# Altium project PCB_Project.PrjPcb (part 1 of 2)
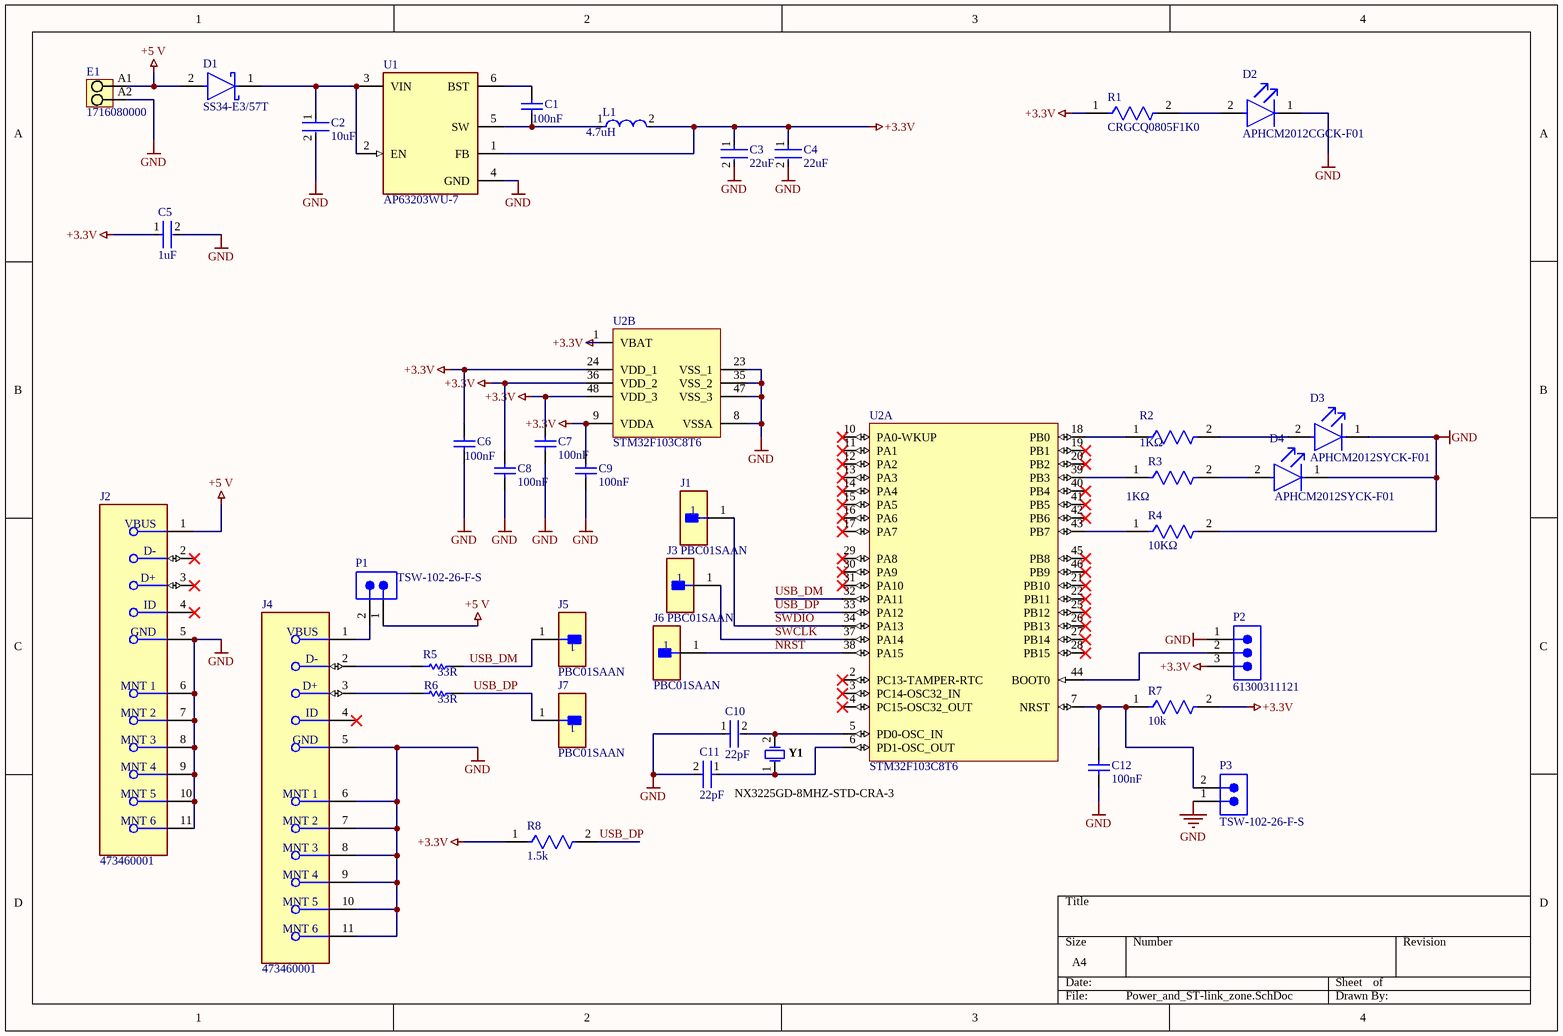
[diagram p0: Power_and_ST-link_zone.SchDoc]
6 sheets, 119 parts. Net scope: global (net labels, ports and power ports of the same name join across sheets).
Board file: PCB1.PcbDoc
Sheets:
  Power_and_ST-link_zone.SchDoc
  Signal_Switching.SchDoc
  Peripherals.SchDoc
  MCU_H7.SchDoc
  MCU_L4.SchDoc
  MCU_WL.SchDoc

## Sheet Power_and_ST-link_zone.SchDoc
size A4; SheetNumber: 1; SheetTotal: 5

### Parts
(Parts that share a designator on the sheet are numbered #1, #2 ... from top to bottom, then left to right.)
C1  100nF  [CAPC2013X145X50NL20T25]
C2  10uF  [FP-C1206C-EH-MFG]
C3  22uF  [FP-GRM21B-0_2-e0_2_0_7-MFG]
C4  22uF  [FP-GRM21B-0_2-e0_2_0_7-MFG]
C5  1uF  [FP-CC0805-0_85-MFG]
C6  100nF  [CAPC2013X145X50NL20T25]
C7  100nF  [CAPC2013X145X50NL20T25]
C8  100nF  [CAPC2013X145X50NL20T25]
C9  100nF  [CAPC2013X145X50NL20T25]
C10  22pF  [FP-C0805C-DN-MFG]
C11  22pF  [FP-C0805C-DN-MFG]
C12  100nF  [CAPC2013X145X50NL20T25]
D1  SS34-E3/57T  [FP-95402-MFG]
D2  APHCM2012CGCK-F01  [FP-APHCM2012CGCK-F01-MFG]
D3  APHCM2012SYCK-F01  [FP-APHCM2012SYCK-F01-MFG]
D4  APHCM2012SYCK-F01  [FP-APHCM2012SYCK-F01-MFG]
E1  1716080000  [LM_5_08_90_02]
J1  PBC01SAAN  [FP-PBC01SAAN-MFG]
J2  473460001  [FP-473460001-MFG]
J3#1  PBC01SAAN  [FP-PBC01SAAN-MFG]
J4  473460001  [FP-473460001-MFG]
J5  PBC01SAAN  [FP-PBC01SAAN-MFG]
J6  PBC01SAAN  [FP-PBC01SAAN-MFG]
J7  PBC01SAAN  [FP-PBC01SAAN-MFG]
L1  4.7uH  [FP-DEM3518C-MFG]
P1  TSW-102-26-F-S  [SMTC-TSW-102-26-XX-S]
P2  61300311121  [61300311121]
P3  TSW-102-26-F-S  [SMTC-TSW-102-26-XX-S]
R1  CRGCQ0805F1K0  [FP-CRGCQ0805-IPC_C]
R2  1KΩ  [FP-CRGCQ0805-IPC_C]
R3  1KΩ  [FP-CRGCQ0805-IPC_C]
R4  10KΩ  [FP-CRGP0805-IPC_C]
R5  33R  [RESC2013X50X30ML20T20]
R6  33R  [RESC2013X50X30ML20T20]
R7  10k  [FP-CRGP0805-IPC_C]
R8#1  1.5k  [FP-CRGCQ0805-IPC_C]
U1  AP63203WU-7  [FP-TSOT26-MFG]
U2  STM32F103C8T6  [STM-LQFP48_L]  (parts A,B of 2)
Y1  NX3225GD-8MHZ-STD-CRA-3  [NDK-NX3225GD-8MHZ-STD-CRA-3_V]

### Nets
+3.3V: C3.1 C4.1 C5.1 C6.2 C7.2 C8.2 C9.2 L1.2 P2.3 R1.1 R7.2 R8#1.1 U1.1(FB) U2.1(VBAT) U2.9(VDDA) U2.24(VDD_1) U2.36(VDD_2) U2.48(VDD_3)
+5 V: D1.2(A) E1.A1 J2.1(VBUS) P1.1
GND: C2.2 C3.2 C4.2 C5.2 C6.1 C7.1 C8.1 C9.1 C10.1 C11.2 C12.1 D2.1(C) D3.1(C) D4.1(C) E1.A2 J2.5(GND) J2.6(MNT_1) J2.7(MNT_2) J2.8(MNT_3) J2.9(MNT_4) J2.10(MNT_5) J2.11(MNT_6) J4.5(GND) J4.6(MNT_1) J4.7(MNT_2) J4.8(MNT_3) J4.9(MNT_4) J4.10(MNT_5) J4.11(MNT_6) P2.1 P3.1 R4.2 U1.4(GND) U2.8(VSSA) U2.23(VSS_1) U2.35(VSS_2) U2.47(VSS_3)
NRST: J6.1 U2.38(PA15)
SWCLK: J3#1.1 U2.37(PA14)
SWDIO: J1.1 U2.34(PA13)
USB_DM: J5.1 R5.2 U2.32(PA11)
USB_DP: J7.1 R6.2 R8#1.2 U2.33(PA12)
NetC1_1: C1.1 L1.1 U1.5(SW)
NetC1_2: C1.2 U1.6(BST)
NetC2_1: C2.1 D1.1(C) U1.2(EN) U1.3(VIN)
NetC10_2: C10.2 U2.5(PD0-OSC_IN) Y1.2
NetC11_1: C11.1 U2.6(PD1-OSC_OUT) Y1.1
NetC12_2: C12.2 P3.2 R7.1 U2.7(NRST)
NetD2_2: D2.2(A) R1.2
NetD3_2: D3.2(A) R2.2
NetD4_2: D4.2(A) R3.2
NetJ4_1: J4.1(VBUS) P1.2
NetJ4_2: J4.2(D-) R5.1
NetJ4_3: J4.3(D+) R6.1
NetP2_2: P2.2 U2.44(BOOT0)
NetR2_1: R2.1 U2.18(PB0)
NetR3_1: R3.1 U2.39(PB3)
NetR4_1: R4.1 U2.43(PB7)

Not connected (* = marked no-connect by the designer): J2 2(D-)* 3(D+)* 4(ID)*; J4 4(ID)*; U2 2(PC13-TAMPER-RTC)* 3(PC14-OSC32_IN)* 4(PC15-OSC32_OUT)* 10(PA0-WKUP)* 11(PA1)* 12(PA2)* 13(PA3)* 14(PA4)* 15(PA5)* 16(PA6)* 17(PA7)* 19(PB1)* 20(PB2)* 21(PB10)* 22(PB11)* 25(PB12)* 26(PB13)* 27(PB14)* 28(PB15)* 29(PA8)* 30(PA9)* 31(PA10)* 40(PB4)* 41(PB5)* 42(PB6)* 45(PB8)* 46(PB9)*

### Library data of the parts
C1 C6-C9 C12 = CMP-2007-01227-1: Manufacturer: Kemet; Part Number: C0805S104K5RACTU
C2 = CMP-03020-004605-1: CAP CER 10UF 25V X7R 1206; Manufacturer Part Number: C1206C106K3RACAUTO; Manufacturer: KEMET; Material: Ceramic; Automotive Grade: Grade 1; Temperature Coefficient: 15%; Tolerance: 10%; Digikey Description: CAP CER 10UF 25V X7R 1206; Lead Free: Yes; Temperature Characteristic: X7R; Temperature: -55°C to +125°C; Temperature Range Low: -55°C; Octopart: https://octopart.com/c1206c106k3racauto-kemet-65707106; Temperature Range High: +125°C; RoHS: TRUE; Package: C1206C-EH; Device Class L1: Passive Components; Device Class L3: Ceramic Capacitors; Automotive: Yes; Value: 10uF; Category: Cap; ComponentLink2Description: Datasheet; Capacitance: 10uF; Height: 1.8mm; ComponentLink2URL: https://content.kemet.com/datasheets/KEM_C1023_X7R_AUTO_SMD.pdf; Voltage Rating: 25V; Device Class L2: Capacitors; Ipc Land Pattern Name: CAPC320160X160
C3 C4 = CMP-06035-051066-1: Chip Multilayer Ceramic Capacitors for General Purpose, 0805, 22uF, X7R, 15%, 20%, 10V
C5 = CMP-03422-000058-1: CC0805 1 uF X7R 10.00% 16 V; Manufacturer: Yageo; Manufacturer Part Number: CC0805KFX7R7BB105; Material: Ceramic; Tolerance: 0.1; Voltage Rating: 16 V; ComponentLink2URL: http://www.yageo.com/documents/recent/UPY-GPHC_Y5V_6.3V-to-50V_8.pdf; Capacitance: 1 uF; Octopart: https://octopart.com/cc0805kfx7r7bb105-yageo-30261725; Footprint Url: http://www.yageo.com/exep/pages/download/literatures/UPY-C_GEN_24.pdf; ComponentLink2Description: Datasheet; Ipc Land Pattern Name: CAPC200125X85; Category: Cap; Device Class L1: Passive Components; Temperature Range High: +85°C; Mouser Description: Multilayer Ceramic Capacitors MLCC - SMD/SMT 1.0uF 16V X7R 10%; Height: 0.95mm; Automotive: No; Device Class L3: Ceramic Capacitors; Temperature: -30°C to +85°C; Temperature Range Low: -30°C; Temperature Characteristic: X7R; Device Class L2: Capacitors; Lead Free: Yes; Value: 1 uF; RoHS: TRUE; Package: CC0805-0.85
C10 C11 = CMP-03020-031064-1: C0805 22 pF C0G 30ppm/°C 10.00% 50 V; Manufacturer Part Number: C0805C220K5GACAUTO; Manufacturer: KEMET; Tolerance: 0.1; Voltage Rating: 50 V; Material: Ceramic; Temperature Range High: +125°C; Package: C0805C-DN; Device Class L1: Passive Components; ComponentLink2URL: https://content.kemet.com/datasheets/KEM_C1003_C0G_SMD.pdf; Lead Free: Yes; Value: 22 pF; Height: 0.88mm; Temperature: -55°C to +125°C; RoHS: TRUE; Device Class L2: Capacitors; Category: Cap; ComponentLink2Description: Datasheet; Device Class L3: Ceramic Capacitors; Automotive: No; Capacitance: 22 pF; Octopart: https://octopart.com/c0805c220k5gacauto-kemet-56246248; Temperature Coefficient: 30ppm/°C; Ipc Land Pattern Name: CAPC200125X78; Temperature Characteristic: C0G; Temperature Range Low: -55°C
D1 = CMP-02539-000012-1: DIODE SCHOTTKY 40V 3A DO214AB; Manufacturer: Vishay; Max Junction Temp: +150°C; Peak Reverse Current: 0.5mA; Max Surge Forward Current: 100A; Standoff Height: 0mm; ComponentLink2Description: Datasheet; Device Class L3: Schottky Diodes; Height: 2.62mm; Max Repetitive Reverse Voltage: 40V; Lead Free: Yes; Package: 95402; Temperature Range High: +150°C; ComponentLink2URL: http://www.vishay.com/docs/88751/ss32.pdf; Temperature: -55°C to +150°C; Footprint Url: http://www.vishay.com/docs/95402/smc.pdf; Automotive: No; Forward Current: 3A; Category: Diode; Manufacturer Part Number: SS34-E3/57T; RoHS: TRUE; Device Class L2: Diodes; Mouser Description: Schottky Diodes & Rectifiers 3.0 Amp 40 Volt; Octopart: https://octopart.com/ss34-e3%2F57t-vishay-39552907; Temperature Range Low: -55°C; Device Class L1: Discrete Semiconductors; Digikey Description: DIODE SCHOTTKY 40V 3A DO214AB
D2 = CMP-44529-000062-1: LED GREEN CLEAR CHIP SMD; Dominant Wavelength: 570nm; Forward Current: 20mA; Number of LEDs: 1; Luminous Intensity: 40mcd; Forward Voltage: 2.1V; Viewing Angle: 110°; Illumination Color: Green; Lens Style: Clear; Mount: Surface Mount; Length: 2mm; Max Operating Temperature: 85°C; Series: APHCM; Width: 1.25mm; Lead Free: Lead Free; Wavelength: 570nm; Package Quantity: 1; Number of Pins: 2; Case Code (Metric): 2012; RoHS Compliant: Yes; Packaging: Tape and Reel; Lens Color: Clear; Case/Package: 0805; Case Code (Imperial): 0805; Test Current: 20mA; Color: Green; Min Operating Temperature: -40°C; Height: 0.4mm
D3 D4 = CMP-44529-000064-1: LED YELLOW CLEAR CHIP SMD; Number of LEDs: 1; Luminous Intensity: 150mcd; Dominant Wavelength: 590nm; Test Current: 20mA; Illumination Color: Green; Forward Voltage: 2V; Viewing Angle: 110°; Number of Pins: 2; Packaging: Tape and Reel; Width: 1.25mm; Height: 0.4mm; Lens Color: Clear; RoHS Compliant: Yes; Lead Free: Lead Free; Min Operating Temperature: -40°C; Case Code (Imperial): 0805; Case/Package: 0805; Series: APHCM; Wavelength: 590nm; Max Operating Temperature: 85°C; Length: 2mm; Color: Yellow; Package Quantity: 2000; Mount: Surface Mount; Lens Style: Clear; Forward Current: 20mA; Case Code (Metric): 2012
E1 = CMP-1559-01766-1: OMNIMATE Signal - series LM; Manufacturer: Weidmueller; Solder_pin_length_mm: 3,5 mm; Solid_max_H05_07_V_U: 2,5 mm²; Contact_material: Cu-Leg; No_of_poles: 2; Mounting_onto_the_PCB: Solder connection; Contact_surface: tinned; Wire_cross_section_AWG_max_UL_1059: AWG 14; Rated_voltage_for_surge_voltage_class_pollution_degree_II_2: 630 V; Side_termination_characteristic: closed side; UL_94_flammability_rating: V-0; Wire_cross_section_AWG_min_UL_1059: AWG 24; Pitch_mm: 5,08 mm; Pitch_inch: 0,2 inch; Rated_voltage_use_group_B_UL_1059: 300 V; Solid_min_H05_07_V_U: 0,2 mm²; Short_text_for_material: LM 5.08/02/90 3.5SN OR BX; Insulating_material: Wemid (PA); Rated_current_use_group_B_UL_1059: 15 A; PartNumber: 1716080000; Colour: Orange; ComponentLink1URL: http://www.weidmueller.com/; ComponentLink1Description: Manufacturer URL; Revision: V1; Qty: 500 PCS; ComponentLink2Description: URL Link1; ComponentLink2URL: http://catalog.weidmueller.com/catalog/Start.do?localeId=en&ObjectID=1716080000; Packaging: Box; PackageReference: LM_5_08_90_02
J1 J3#1 J5-J7 = CMP-25680-000032-1: CONN HEADER VERT 1POS; Number of Positions: 1; Connector Type: Male Pin; Gender: Male; Pitch: 2.54mm; Contact Material: Bronze; Mount: Through Hole; Length: 2.54mm; Height: 2.54mm; Lead Free: Lead Free; Number of Rows: 1; Contact Plating: Gold; Number of Contacts: 1; Housing Material: Plastic; Termination: Solder; Package Quantity: 1; Packaging: Bulk; Color: Black; Contact Mating Length: 0.23inch; Housing Color: Black; Width: 2.54mm
J2 J4 = CMP-2000-05246-2: CONN RCPT USB2.0 MICRO B SMD R/A; Manufacturer: Molex; Conn Orientation: Right Angle; Is Female: yes; Shielding: true; Pitch: 0.65mm; Number Of Contacts: 5; Voltage Rating: 30V; Current Rating: 1.8A; Device Class L2: USB Connectors; Digikey Description: CONN RCPT USB2.0 MICRO B SMD R/A; Height: 2.945mm; RoHS: TRUE; ComponentLink2Description: Datasheet; Octopart: https://octopart.com/47346-0001-molex-7164928; Automotive: No; Package: 0; Category: Conn; Device Class L1: Connectors; Usb Standard: USB 2.0; Temperature: -30°C to +85°C; Temperature Range Low: -30°C; Footprint Url: https://www.molex.com/pdm_docs/sd/473460001_sd.pdf; ComponentLink2URL: https://www.molex.com/webdocs/datasheets/pdf/en-us/0473460001_IO_CONNECTORS.pdf; Lead Free: Yes; Manufacturer Part Number: 473460001; Contact Material: Gold,Nickel; Temperature Range High: +85°C; Device Class L3: unset
L1 = CMP-06042-016301-1: FIXED IND; Shielding: Shielded; Saturation Current: 1.35A; Test Frequency: 100kHz; DC Resistance (DCR): 72mR; Core Material: Ferrite; Current Rating: 2A; Tolerance: 20%; Height - Seated (Max): 0.071inch; RoHS Compliant: Yes; Length: 0.146inch; Min Operating Temperature: -40°C; Max Operating Temperature: 85°C; Mount: Surface Mount; Case/Package: Nonstandard; Width: 0.154inch; Packaging: Tape and Reel; Resistor Type: Wirewound; Inductance: 4.7uH
P1 P3 = CMP-1024-00329-1: 0.025" SQ Post Header, Through-hole, Vertical, -55 to 125 degC, 2.54 mm Pitch, 2-Pin, Male, RoHS; Manufacturer: Samtec; Pitch: 2.54 mm; PackageVersion: DM, 8/1988; ComponentLink2Description: Datasheet; PackageReference: TSW-102-26-XX-S; ComponentLink3URL: http://www.samtec.com/documents/webfiles/cpdf/TSW-XXX-XX-XXX-X-XX-XXX-MKT.pdf; ComponentLink2URL: http://www.samtec.com/documents/webfiles/pdf/TSW_TH.PDF; ComponentLink1Description: Manufacturer URL; DatasheetVersion: F-214; RoHS: True; ComponentLink3Description: Package Specification; PartNumber: TSW-102-26-F-S; Temperature Range: -55 to 125 degC; Orientation: Vertical; ComponentLink1URL: http://www.samtec.com; PackageDescription: .025[0.64] SQ. Post Terminal Strip Assembly; Mounting Technology: Through-hole
P2 = CMP-1502-01062-3: NexarPartId: 32855521; Current Rating: 3A; Voltage Rating: 250V; Number of Positions: 3; Pitch: 2.54mm; Contact Resistance: 20mΩ; Connector Type: Male Pin; Gender: Male; REACH SVHC: Unknown; Packaging: Bulk; Contact Material: Copper; Min Operating Temperature: -40°C; Number of Rows: 1; Orientation: Vertical; RoHS: Compliant; Contact Plating: Gold; Max Operating Temperature: 105°C; Mount: Through Hole; Height: 8.94mm; Operating Supply Voltage: 250V; Number of Pins: 3; Contact Mating Length: 5.9944mm; Number of Contacts: 3; Color: Black; Lead Free: Lead Free; Lead Pitch: 2.54mm; Termination: Solder
R1 = CMP-03211-004613-1: CRGCQ 0805 1K0 1%; Manufacturer: TE Connectivity; Value: 1KΩ; Power Rating: 0.125W; Temperature Coefficient: ±100ppm/°C; Tolerance: 0.01; Automotive Grade: Grade 685; Voltage Rating: 150V; Digikey Description: CRGCQ 0805 1K0 1%; Octopart: https://octopart.com/crgcq0805f1k0-te+connectivity-91018154; ComponentLink2Description: Datasheet; Ipc Land Pattern Name: RESC200125X55; Device Class L2: Resistors; Device Class L1: Passive Components; Category: Res; Device Class L3: Chip SMD Resistors; Temperature Range Low: -55°C; Temperature Range High: +155°C; Automotive: Yes; Height: 0.65mm; Resistance: 1KΩ; ComponentLink2URL: https://www.te.com/commerce/DocumentDelivery/DDEController?Action=showdoc&DocId=Data+Sheet%7F1773204-3%7F1%7Fpdf%7FEnglish%7FENG_DS_1773204-3_1.pdf%7F4-2176341-694; Manufacturer Part Number: CRGCQ0805F1K0; Series: CRGCQ; Temperature: -55°C to +155°C; Composition: Thick Film; Lead Free: Yes; RoHS: TRUE; Ambient Temperature Range High: +70°C; Package: CRGCQ0805
R2 R3 = CMP-03211-004613-1: CRGCQ 0805 1K0 1%; Manufacturer: TE Connectivity; Manufacturer Part Number: CRGCQ0805F1K0; Power Rating: 0.125W; Temperature Coefficient: ±100ppm/°C; Tolerance: 0.01; Automotive Grade: Grade 685; Voltage Rating: 150V; Digikey Description: CRGCQ 0805 1K0 1%; Octopart: https://octopart.com/crgcq0805f1k0-te+connectivity-91018154; ComponentLink2Description: Datasheet; Ipc Land Pattern Name: RESC200125X55; Device Class L2: Resistors; Value: 1KΩ; Device Class L1: Passive Components; Category: Res; Device Class L3: Chip SMD Resistors; Temperature Range Low: -55°C; Temperature Range High: +155°C; Automotive: Yes; Height: 0.65mm; Resistance: 1KΩ; ComponentLink2URL: https://www.te.com/commerce/DocumentDelivery/DDEController?Action=showdoc&DocId=Data+Sheet%7F1773204-3%7F1%7Fpdf%7FEnglish%7FENG_DS_1773204-3_1.pdf%7F4-2176341-694; Series: CRGCQ; Temperature: -55°C to +155°C; Composition: Thick Film; Lead Free: Yes; RoHS: TRUE; Ambient Temperature Range High: +70°C; Package: CRGCQ0805
R4 = CMP-03211-006861-1: CRGP 0805 10K 1%; Manufacturer Part Number: CRGP0805F10K; Manufacturer: TE; Power Rating: 0.33W; Voltage Rating: 150V; Tolerance: 0.01; Temperature Coefficient: ±100ppm/°C; ComponentLink2URL: https://www.mouser.com/datasheet/2/418/NG_DS_9-1773463-9_A-1358566.pdf; Temperature Range Low: -55°C; Ipc Land Pattern Name: RESC200125X55; Device Class L2: Resistors; Automotive: No; Device Class L3: Chip SMD Resistors; Composition: Thick Film; Temperature Range High: +155°C; Temperature: -55°C to +155°C; Height: 0.65mm; Series: CRGP; RoHS: TRUE; Device Class L1: Passive Components; Value: 10KΩ; Octopart: https://octopart.com/crgp0805f10k-te+connectivity-91018782; Package: CRGP0805; Digikey Description: CRGP 0805 10K 1%; Ambient Temperature Range High: +70°C; Lead Free: Yes; ComponentLink2Description: Datasheet; Category: Res; Resistance: 10KΩ
R5 R6 = CMP-1013-00038-2: Manufacturer: Vishay Dale; Part Number: CRCW080533R0JNEA
R7 = CMP-03211-006861-1: CRGP 0805 10K 1%; Manufacturer Part Number: CRGP0805F10K; Manufacturer: TE; Power Rating: 0.33W; Voltage Rating: 150V; Value: 10KΩ; Tolerance: 0.01; Temperature Coefficient: ±100ppm/°C; ComponentLink2URL: https://www.mouser.com/datasheet/2/418/NG_DS_9-1773463-9_A-1358566.pdf; Temperature Range Low: -55°C; Ipc Land Pattern Name: RESC200125X55; Device Class L2: Resistors; Automotive: No; Device Class L3: Chip SMD Resistors; Composition: Thick Film; Temperature Range High: +155°C; Temperature: -55°C to +155°C; Height: 0.65mm; Series: CRGP; RoHS: TRUE; Device Class L1: Passive Components; Octopart: https://octopart.com/crgp0805f10k-te+connectivity-91018782; Package: CRGP0805; Digikey Description: CRGP 0805 10K 1%; Ambient Temperature Range High: +70°C; Lead Free: Yes; ComponentLink2Description: Datasheet; Category: Res; Resistance: 10KΩ
R8#1 = CMP-03211-002424-1: CRGCQ0805 1.5KΩ 0.125W ±100ppm/°C 1% 150V; Manufacturer: TE Connectivity; Manufacturer Part Number: CRGCQ0805F1K5; Tolerance: 0.01; Automotive Grade: Grade 721; Power Rating: 0.125W; Resistance: 1.5KΩ; Temperature Range High: +155°C; Automotive: Yes; Series: CRGCQ; Octopart: https://octopart.com/crgcq0805f1k5-te+connectivity-91018156; Temperature: -55°C to +155°C; Device Class L2: Resistors; Height: 0.65mm; Composition: Thick Film; Ipc Land Pattern Name: RESC200125X55; Voltage Rating: 150V; Ambient Temperature Range High: +70°C; Temperature Range Low: -55°C; RoHS: TRUE; Lead Free: Yes; Value: 1.5KΩ; Device Class L3: Chip SMD Resistors; Temperature Coefficient: ±100ppm/°C; ComponentLink2Description: Datasheet; Category: Res; Device Class L1: Passive Components; ComponentLink2URL: https://www.te.com/commerce/DocumentDelivery/DDEController?Action=showdoc&DocId=Data+Sheet%7F1773204-3%7F1%7Fpdf%7FEnglish%7FENG_DS_1773204-3_1.pdf%7F4-2176341-730; Package: CRGCQ0805
U1 = CMP-12757-000006-1: IC REG BUCK 3.3V 2A TSOT26; Manufacturer: Diodes Inc.; Output Type: Fixed; Min Supply Voltage: 3.8V; Number Of Outputs: 1; Max Junction Temp: +160°C; Nominal Supply Current: 22uA; Standoff Height: 0.01mm; Switching Frequency: 1.1MHz; Max Supply Voltage: 32V; ComponentLink2Description: Datasheet; Device Class L1: Integrated Circuits (ICs); Temperature: to +160°C; Device Class L3: Voltage Regulators - Switching; RoHS: TRUE; Octopart: https://octopart.com/ap63203wu-7-diodes+inc.-98099550; Output Voltage: 3.3V; Lead Free: Yes; ComponentLink2URL: https://www.diodes.com/assets/Datasheets/AP63200-AP63201-AP63203-AP63205.pdf; Digikey Description: IC REG BUCK 3.3V 2A TSOT26; Footprint Url: https://www.diodes.com/assets/Package-Files/TSOT26.pdf; Ambient Temperature Range High: +85°C; Height: 1mm; Automotive: No; Temperature Range High: +160°C; Switching Topology: Buck; Output Current: 2A; Package: TSOT26; Category: IC; Mouser Description: AP63203 Series 3.3 V 2 A SMT Fixed Low IQ Synchronous Buck - TSOT-26; Device Class L2: Power Management ICs; Ambient Temperature Range Low: -40°C; Manufacturer Part Number: AP63203WU-7
U2 = CMP-0237-00215-3: ARM Cortex-M3 32-bit MCU, 64 KB Flash, 20 KB Internal RAM, 37 I/Os, 48-pin LQFP, -40 to 85 degC, Tray; Supply Voltage(Vcc) min (V): 2; Internal RAM Size (kB): 20; FLASH Size (Prog) (kB): 64; A/D Converter: 2x12-bit (10 Channel); I/Os (High Current): 37; Operating Frequency(F) (Processor speed) (MHz): 72; Core: ARM Cortex-M3; ComponentLink3Description: Package Specification; Mounting Technology: Surface Mount; PartNumber: STM32F103C8T6; PackageReference: LQFP48; Packing: Tray; ComponentLink3URL: http://www.st.com/st-web-ui/static/active/en/resource/technical/document/datasheet/DM00058181.pdf; DatasheetVersion: Rev. 16; ComponentLink1URL: http://www.st.com/web/en/home.html; PackageVersion: Rev. 6, 06/2013; ComponentLink2URL: http://www.st.com/st-web-ui/static/active/en/resource/technical/document/datasheet/CD00161566.pdf; ComponentLink1Description: Manufacturer URL; ComponentLink2Description: Datasheet; PackageDescription: 48-Pin Low Profile Quad Flat Package, 7 x 7 mm Body, 0.5 mm Pitch
Y1 = CMP-2000-07595-1: Crystal Unit, 8 MHz, 8 pF, -40 to 150 degC, 2-Pin SMD, RoHS, Tape and Reel; Manufacturer: NDK; Load Capacitance: 8pF; ESR (Equivalent Series Resistance): 500Ohm; Frequency Tolerance: 50ppm; Frequency Stability: 150ppm; Frequency: 8MHz; Case/Package: SMD/SMT; Datasheet Version: 11/2016; Min Operating Temperature: -40degC; Packaging: TapeandReel; Width: 0.098inch; Package Quantity: 3000; Number of Pins: 2; Package Description: 2-Pin Surface Mount Device, Body 3.2 x 2.5 mm; RoHSCompliant: True; Package Reference: NX3225GD-8MHZ-STD-CRA-3; Datasheet URL: http://www.ndk.com/images/products/catalog/c_NX3225GD-STD-CRA-3_e.pdf; Mounting Technology: SurfaceMount; Length: 0.126inch; Mount: SurfaceMount; Manufacturer URL: http://www.ndk.com/en/; Max Operating Temperature: 150degC; Height: 0.039inch

## Sheet Signal_Switching.SchDoc
size A4; SheetNumber: 2; SheetTotal: 6
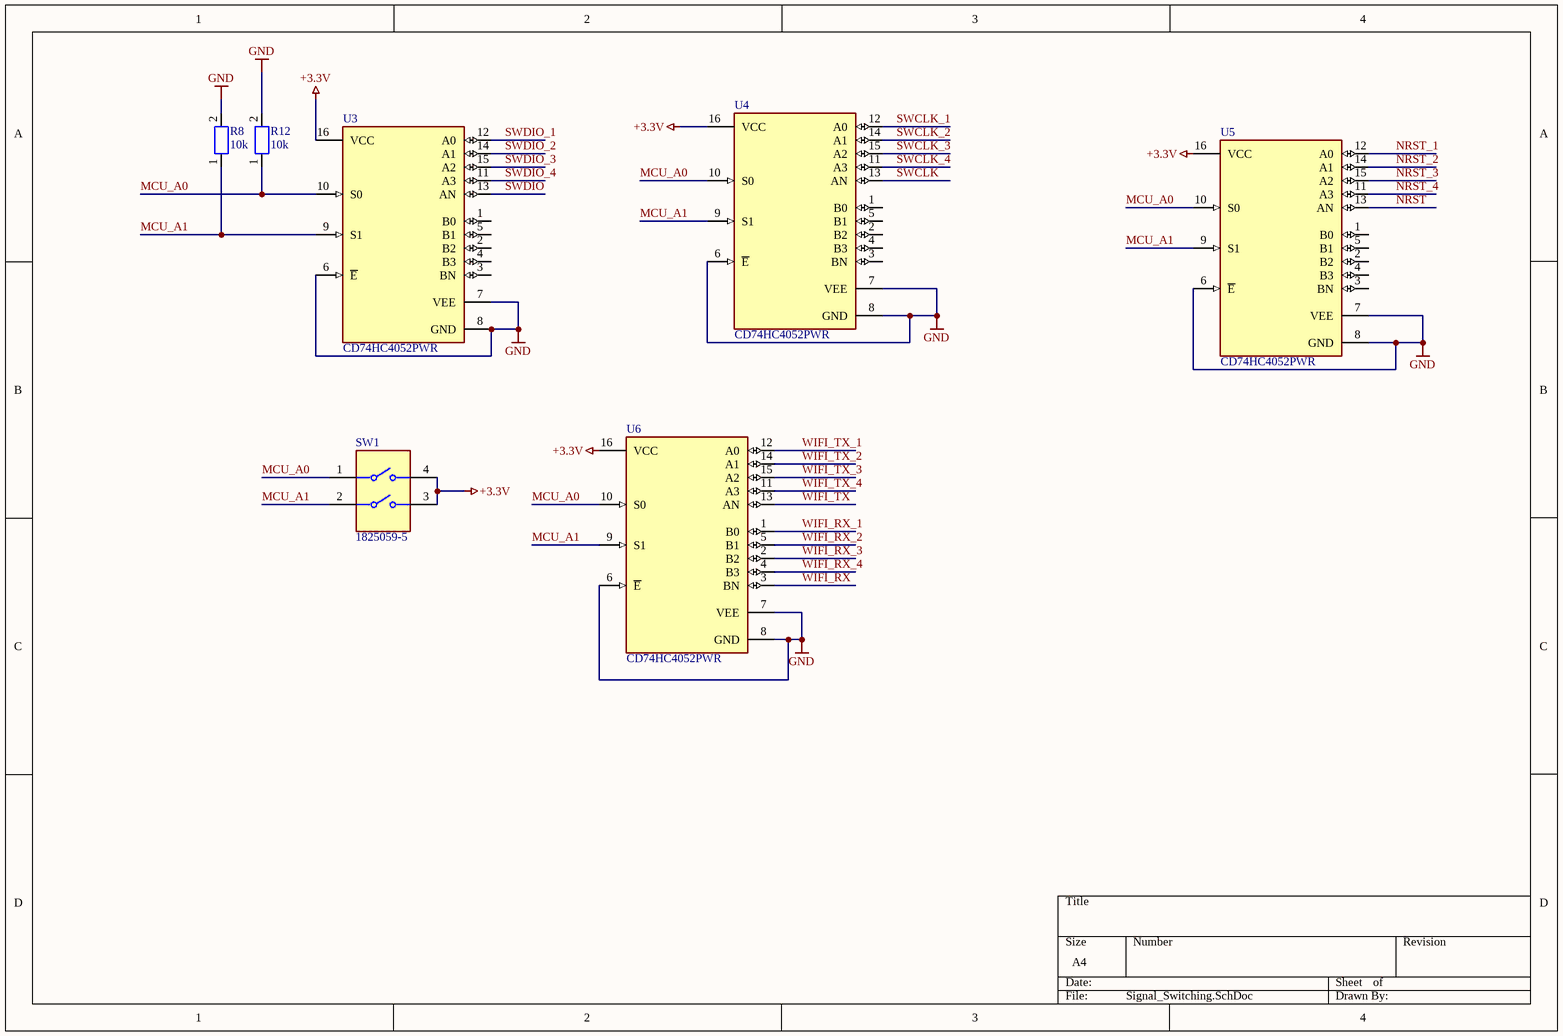
[diagram p1: Signal_Switching.SchDoc]

### Parts
(Parts that share a designator on the sheet are numbered #1, #2 ... from top to bottom, then left to right.)
R8#2  10k  [FP-CRGP0805-IPC_A]
R12#1  10k  [FP-CRGP0805-IPC_A]
SW1  1825059-5  [FP-1825059-5-MFG]
U3  CD74HC4052PWR  [FP-PW0016A-MFG]
U4  CD74HC4052PWR  [FP-PW0016A-MFG]
U5  CD74HC4052PWR  [FP-PW0016A-MFG]
U6  CD74HC4052PWR  [FP-PW0016A-MFG]

### Nets
+3.3V: SW1.3 SW1.4 U3.16(VCC) U4.16(VCC) U5.16(VCC) U6.16(VCC)
GND: R8#2.2 R12#1.2 U3.6(~{E}) U3.7(VEE) U3.8(GND) U4.6(~{E}) U4.7(VEE) U4.8(GND) U5.6(~{E}) U5.7(VEE) U5.8(GND) U6.6(~{E}) U6.7(VEE) U6.8(GND)
MCU_A0: R12#1.1 SW1.1 U3.10(S0) U4.10(S0) U5.10(S0) U6.10(S0)
MCU_A1: R8#2.1 SW1.2 U3.9(S1) U4.9(S1) U5.9(S1) U6.9(S1)
NRST: U5.13(AN)
NRST_1: U5.12(A0)
NRST_2: U5.14(A1)
NRST_3: U5.15(A2)
NRST_4: U5.11(A3)
SWCLK: U4.13(AN)
SWCLK_1: U4.12(A0)
SWCLK_2: U4.14(A1)
SWCLK_3: U4.15(A2)
SWCLK_4: U4.11(A3)
SWDIO: U3.13(AN)
SWDIO_1: U3.12(A0)
SWDIO_2: U3.14(A1)
SWDIO_3: U3.15(A2)
SWDIO_4: U3.11(A3)
WIFI_RX: U6.3(BN)
WIFI_RX_1: U6.1(B0)
WIFI_RX_2: U6.5(B1)
WIFI_RX_3: U6.2(B2)
WIFI_RX_4: U6.4(B3)
WIFI_TX: U6.13(AN)
WIFI_TX_1: U6.12(A0)
WIFI_TX_2: U6.14(A1)
WIFI_TX_3: U6.15(A2)
WIFI_TX_4: U6.11(A3)

Not connected (* = marked no-connect by the designer): U3 1(B0) 2(B2) 3(BN) 4(B3) 5(B1); U4 1(B0) 2(B2) 3(BN) 4(B3) 5(B1); U5 1(B0) 2(B2) 3(BN) 4(B3) 5(B1)

### Library data of the parts
R8#2 R12#1 = CMP-03211-006861-1: as R7 on sheet Power_and_ST-link_zone; ComponentLink2URL: https://www.mouser.com/datasheet/2/418/NG_DS_9-1773463-9_A-1358566.pdf; Temperature Range Low: -55°C; Ipc Land Pattern Name: RESC200125X55; Device Class L2: Resistors; Automotive: No; Device Class L3: Chip SMD Resistors; Composition: Thick Film; Temperature Range High: +155°C; Temperature: -55°C to +155°C; Height: 0.65mm; Series: CRGP; RoHS: TRUE; Device Class L1: Passive Components; Octopart: https://octopart.com/crgp0805f10k-te+connectivity-91018782; Package: CRGP0805; Digikey Description: CRGP 0805 10K 1%; Ambient Temperature Range High: +70°C; Lead Free: Yes; ComponentLink2Description: Datasheet; Category: Res; Resistance: 10KΩ
SW1 = CMP-03400-000020-1: SWITCH SLIDE DIP SPST 100MA 24V; Number of Circuits: 2; Contact Current Rating: 1A; Actuator Type: Standard; Washable: Yes; Sealable: Yes (With); Pitch: 0.1inch; Voltage Rating (DC): 5V; RoHS Compliant: Yes; Max Voltage Rating (DC): 24V; Max Current Rating: 100mA; Throw Configuration: SPST; Housing Color: Black; Type: Switch; ELV: Compliant; Flammability Rating: UL94 V-0; Max Operating Temperature: 85°C; Termination: Gull Wing; Mount: Surface Mount; Contact Material: Copper Alloy; Length: 7.06mm; Radiation Hardening: No; Packaging: Rail/Tube; Lead Free: Lead Free; Package Quantity: 60; Min Operating Temperature: -30°C; Contact Plating: Gold; Height: 0.138inch; Housing Material: Polyphenylene; Series: ADF, Alcoswitch; Orientation: Straight; Number of Positions: 2
U3-U6 = CMP-1575-00095-5: IC MUX/DEMUX DUAL 4X1 16TSSOP; Throw Configuration: SP4T; Turn-Off Delay Time: 250ns; Low Level Output Current: 25mA; Polarity: Non-Inverting; Min Supply Voltage: 2V; Logic Function: Multiplexer; Max Supply Voltage: 6V; Propagation Delay: 60ns; Max Dual Supply Voltage: 5V; Turn-On Delay Time: 325ns; Supply Type: Single; Number of Bits: 4; Number of Inputs: 8; On-State Resistance: 130R; Number of Outputs: 2; Nominal Supply Current: 16uA; Bandwidth: 185MHz; Dual Supply Voltage: 3V; Min Dual Supply Voltage: 1V; Lead Free: Lead Free; Min Operating Temperature: -55°C; Contact Plating: Gold; Length: 5mm; Case/Package: TSSOP; Mount: Surface Mount; Package Quantity: 1; Number of Channels: 2; Radiation Hardening: No; Packaging: Tape and Reel; Number of Pins: 16; Width: 4.4mm; High Level Output Current: 25mA; Max Operating Temperature: 125°C; Weight: 0.002183oz; Number of Circuits: 2; REACH SVHC: No SVHC; Height: 1.15mm

## Sheet Peripherals.SchDoc
size A4; SheetNumber: 3; SheetTotal: 5
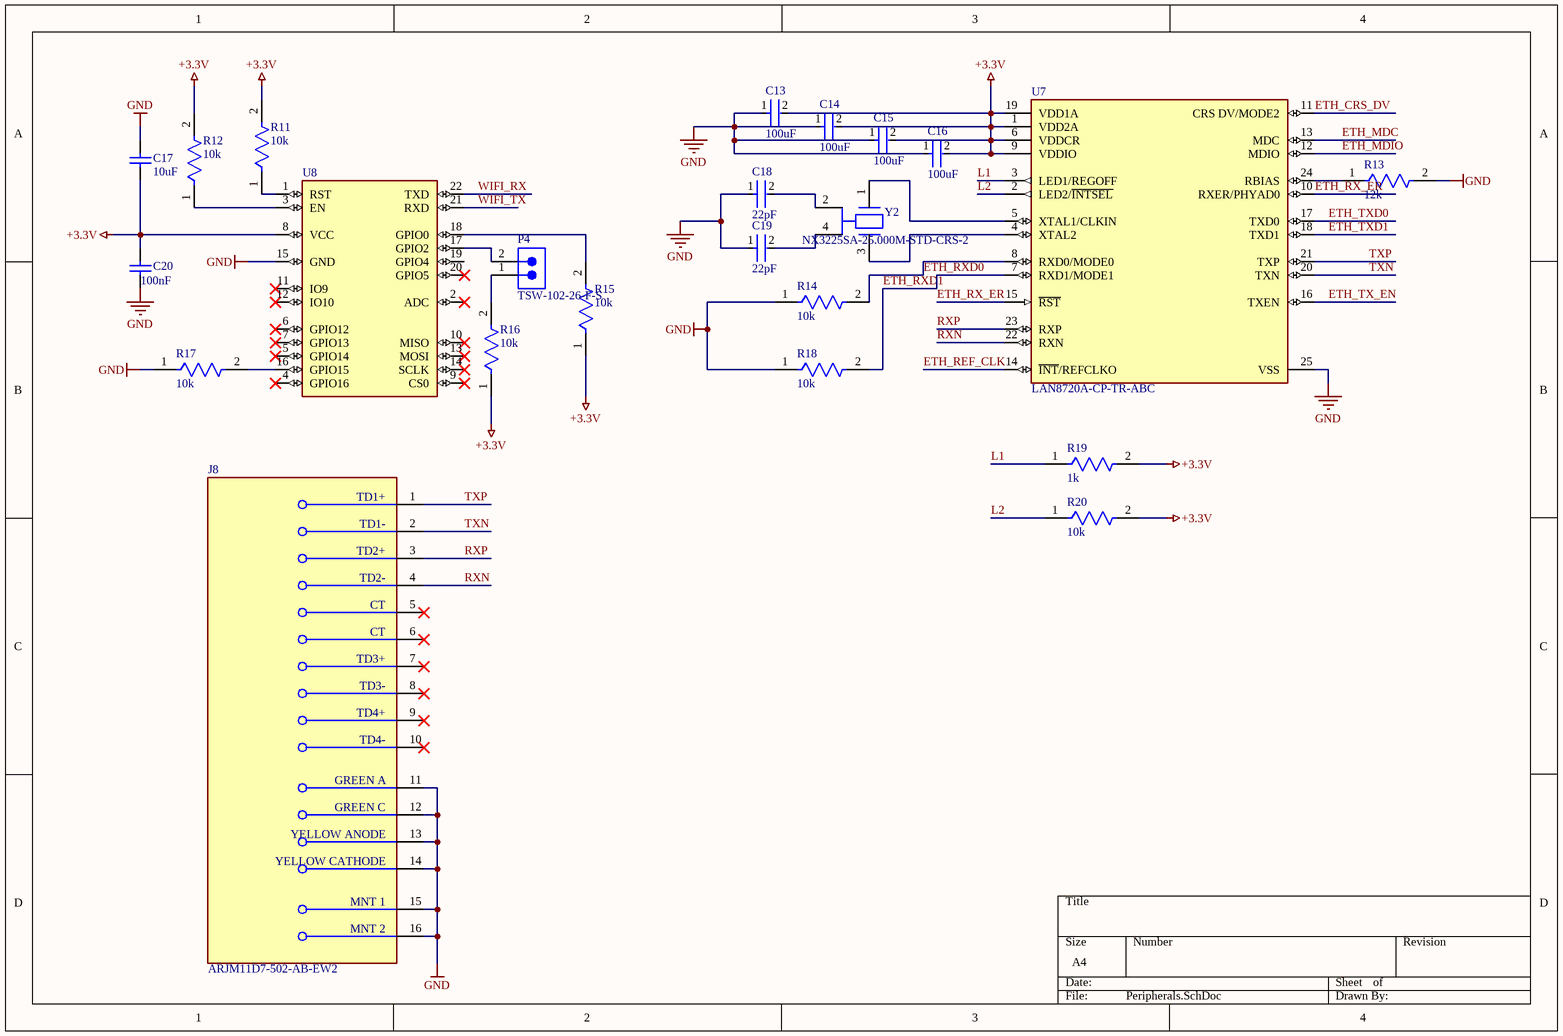
[diagram p2: Peripherals.SchDoc]

### Parts
(Parts that share a designator on the sheet are numbered #1, #2 ... from top to bottom, then left to right.)
C13  100uF  [FP-GRM21B-0_2-e0_2_0_7-IPC_A]
C14#1  100uF  [FP-GRM21B-0_2-e0_2_0_7-IPC_A]
C15#1  100uF  [FP-GRM21B-0_2-e0_2_0_7-IPC_A]
C16#1  100uF  [FP-GRM21B-0_2-e0_2_0_7-IPC_A]
C17#1  10uF  [CAPC2013X140X50ML20T25]
C18#1  22pF  [FP-C0805C-DN-MFG]
C19#1  22pF  [FP-C0805C-DN-MFG]
C20#1  100nF  [CAPC2013X145X50NL20T25]
J8  ARJM11D7-502-AB-EW2  [FP-ARJM11D7-502-AB-EW2-MFG]
P4  TSW-102-26-F-S  [SMTC-TSW-102-26-XX-S]
R11  10k  [FP-CRGP0805-IPC_C]
R12#2  10k  [FP-CRGP0805-IPC_C]
R13  12k  [FP-CRGCQ0805-IPC_C]
R14  10k  [FP-CRGP0805-IPC_C]
R15  10k  [FP-CRGP0805-IPC_C]
R16  10k  [FP-CRGP0805-IPC_C]
R17  10k  [FP-CRGP0805-IPC_C]
R18  10k  [FP-CRGP0805-IPC_C]
R19  1k  [FP-RN73R2A-IPC_A]
R20  10k  [FP-CRGP0805-IPC_C]
U7  LAN8720A-CP-TR-ABC  [FP-24-S4QFN-4x4B-0_5P-IPC_B]
U8  (no value)  [ESP-12F]
Y2  NX3225SA-25.000M-STD-CRS-2  [FP-NX3225SA-MFG]

### Nets
+3.3V: C13.2 C14#1.2 C15#1.2 C16#1.2 C17#1.1 C20#1.2 R11.2 R12#2.2 R15.1 R16.1 R19.2 R20.2 U7.1(VDD2A) U7.6(VDDCR) U7.9(VDDIO) U7.19(VDD1A) U8.8(VCC)
GND: C13.1 C14#1.1 C15#1.1 C16#1.1 C17#1.2 C18#1.1 C19#1.1 C20#1.1 J8.11(GREEN_A) J8.12(GREEN_C) J8.13(YELLOW_ANODE) J8.14(YELLOW_CATHODE) J8.15(MNT_1) J8.16(MNT_2) R13.2 R14.1 R17.1 R18.1 U7.25(VSS) U8.15(GND)
ETH_CRS_DV: U7.11(CRS_DV/MODE2)
ETH_MDC: U7.13(MDC)
ETH_MDIO: U7.12(MDIO)
ETH_REF_CLK: U7.14(~{INT}/REFCLKO)
ETH_RX_ER: U7.10(RXER/PHYAD0) U7.15(~{RST})
ETH_RXD0: R14.2 U7.8(RXD0/MODE0)
ETH_RXD1: R18.2 U7.7(RXD1/MODE1)
ETH_TX_EN: U7.16(TXEN)
ETH_TXD0: U7.17(TXD0)
ETH_TXD1: U7.18(TXD1)
L1: R19.1 U7.3(LED1/REGOFF)
L2: R20.1 U7.2(LED2/~{INTSEL})
RXN: J8.4(TD2-) U7.22(RXN)
RXP: J8.3(TD2+) U7.23(RXP)
TXN: J8.2(TD1-) U7.20(TXN)
TXP: J8.1(TD1+) U7.21(TXP)
WIFI_RX: U8.22(TXD)
WIFI_TX: U8.21(RXD)
NetC18#1_2: C18#1.2 Y2.2(GND)
NetC19#1_2: C19#1.2 Y2.4(GND)
NetP4_1: P4.1 R16.2
NetP4_2: P4.2 U8.17(GPIO2)
NetR11_1: R11.1 U8.1(RST)
NetR12#2_1: R12#2.1 U8.3(EN)
NetR13_1: R13.1 U7.24(RBIAS)
NetR15_2: R15.2 U8.18(GPIO0)
NetR17_2: R17.2 U8.16(GPIO15)
NetU7_4: U7.4(XTAL2) Y2.3
NetU7_5: U7.5(XTAL1/CLKIN) Y2.1

Not connected (* = marked no-connect by the designer): J8 5(CT)* 6(CT)* 7(TD3+)* 8(TD3-)* 9(TD4+)* 10(TD4-)*; U8 2(ADC)* 4(GPIO16)* 5(GPIO14)* 6(GPIO12)* 7(GPIO13)* 9(CS0)* 10(MISO)* 11(IO9)* 12(IO10)* 13(MOSI)* 14(SCLK)* 19(GPIO4) 20(GPIO5)*

### Library data of the parts
C13 C14#1 C15#1 C16#1 = CMP-06035-016811-1: Chip Multilayer Ceramic Capacitors for General Purpose, 0805, 100uF, X6S, 22%, 20%, 2.5V; Voltage Rating (DC): 2.5V; Capacitance: 100uF; Width: 0.049inch; Case Code (Metric): 2012; Dielectric: X6S; Thickness: 0.057inch; Tolerance: 20%; Length: 0.079inch; Packaging: Tape and Reel; Case/Package: 0805; Case Code (Imperial): 0805; Min Operating Temperature: -55°C; Max Operating Temperature: 105°C; Voltage Rating: 2.5V; Mount: Surface Mount
C17#1 = CMP-2007-04702-1: Manufacturer: AVX Interconnect / Elco; Part Number: 0805ZC106KAT2A
C18#1 C19#1 = CMP-2007-00314-2: CAP CER 22PF 100V 10% NP0 0805; Manufacturer Part Number: C0805C220K1GACTU; Manufacturer: KEMET; Temperature Characteristic: C0G; Tolerance: 0.1; Material: Ceramic; Temperature Coefficient: 30ppm/°C; ComponentLink2Description: Datasheet; Digikey Description: CAP CER 22PF 100V 10% NP0 0805; Value: 22 pF; Temperature Range High: +125°C; Package: C0805C-DN; Voltage Rating: 100 V; Octopart: https://octopart.com/c0805c220k1gactu-kemet-9138624; Capacitance: 22 pF; Lead Free: Yes; Temperature: -55°C to +125°C; Category: Cap; Device Class L3: Ceramic Capacitors; ComponentLink2URL: https://content.kemet.com/datasheets/KEM_C1003_C0G_SMD.pdf; Ipc Land Pattern Name: CAPC200125X78; Automotive: No; Mouser Description: Cap Ceramic 22pF 100V C0G 10% SMD 0805 125°C Plastic T/R; RoHS: TRUE; Height: 0.88mm; Device Class L1: Passive Components; Temperature Range Low: -55°C; Device Class L2: Capacitors
C20#1 = CMP-2007-01227-1: as C1 on sheet Power_and_ST-link_zone
J8 = CMP-27893-000003-1: CONN JACK 1PORT 1000 BASE-T PCB; Number of Ports: 1; Connector Type: RJ45; Shielding: Shielded; Direction: Up; Number of Cores per Jack: 8; Max Operating Temperature: 85°C; Min Operating Temperature: -40°C; Contact Plating: Gold; RoHS Compliant: Yes; Termination: Solder; Mount: Through Hole; Color: Green; Number of Rows: 1; Packaging: Tray
P4 = CMP-1024-00329-1: as P1 on sheet Power_and_ST-link_zone; PackageVersion: DM, 8/1988; ComponentLink2Description: Datasheet; PackageReference: TSW-102-26-XX-S; ComponentLink3URL: http://www.samtec.com/documents/webfiles/cpdf/TSW-XXX-XX-XXX-X-XX-XXX-MKT.pdf; ComponentLink2URL: http://www.samtec.com/documents/webfiles/pdf/TSW_TH.PDF; ComponentLink1Description: Manufacturer URL; DatasheetVersion: F-214; RoHS: True; ComponentLink3Description: Package Specification; PartNumber: TSW-102-26-F-S; Temperature Range: -55 to 125 degC; Orientation: Vertical; ComponentLink1URL: http://www.samtec.com; PackageDescription: .025[0.64] SQ. Post Terminal Strip Assembly; Mounting Technology: Through-hole
R11 R12#2 R14-R18 R20 = CMP-03211-006861-1: as R7 on sheet Power_and_ST-link_zone; ComponentLink2URL: https://www.mouser.com/datasheet/2/418/NG_DS_9-1773463-9_A-1358566.pdf; Temperature Range Low: -55°C; Ipc Land Pattern Name: RESC200125X55; Device Class L2: Resistors; Automotive: No; Device Class L3: Chip SMD Resistors; Composition: Thick Film; Temperature Range High: +155°C; Temperature: -55°C to +155°C; Height: 0.65mm; Series: CRGP; RoHS: TRUE; Device Class L1: Passive Components; Octopart: https://octopart.com/crgp0805f10k-te+connectivity-91018782; Package: CRGP0805; Digikey Description: CRGP 0805 10K 1%; Ambient Temperature Range High: +70°C; Lead Free: Yes; ComponentLink2Description: Datasheet; Category: Res; Resistance: 10KΩ
R13 = CMP-03211-010457-1: CRGCQ 0805 12K 1%; Manufacturer Part Number: CRGCQ0805F12K; Manufacturer: TE Connectivity; Automotive Grade: Grade 929; Tolerance: 0.01; Voltage Rating: 150V; Power Rating: 0.125W; Resistance: 12KΩ; Value: 12KΩ; Temperature Coefficient: ±100ppm/°C; Ipc Land Pattern Name: RESC200125X55; Temperature Range High: +155°C; Automotive: Yes; Ambient Temperature Range High: +70°C; Digikey Description: CRGCQ 0805 12K 1%; ComponentLink2Description: Datasheet; Height: 0.65mm; ComponentLink2URL: https://www.te.com/commerce/DocumentDelivery/DDEController?Action=showdoc&DocId=Data+Sheet%7F1773204-3%7F1%7Fpdf%7FEnglish%7FENG_DS_1773204-3_1.pdf%7F4-2176341-938; Device Class L2: Resistors; RoHS: TRUE; Temperature Range Low: -55°C; Octopart: https://octopart.com/crgcq0805f12k-te+connectivity-91018144; Category: Res; Composition: Thick Film; Package: CRGCQ0805; Device Class L3: Chip SMD Resistors; Temperature: -55°C to +155°C; Device Class L1: Passive Components; Lead Free: Yes; Series: CRGCQ
R19 = CMP-04015-026717-1: 1kΩ ±0.1% 0.125W, 1/8W Chip Resistor 0805 (2012 Metric) Moisture Resistant Thin Film
U7 = CMP-06281-000039-1: IC TRANSCEIVER FULL 2/2 24SQFN; Simplex/Duplex: Full Duplex; Max Operating Temperature: 85°C; Packaging: Tape and Reel; Min Operating Temperature: 0°C; Mount: Surface Mount
U8 = ESP-12F: WiFi Module; MF: AI-Thinker; SnapEDA_Link: https://www.snapeda.com/parts/ESP-12F/AI-Thinker/view-part/?ref=snap; Package: Package; Value: *; MP: ESP-12F; Check_prices: https://www.snapeda.com/parts/ESP-12F/AI-Thinker/view-part/?ref=eda; Supplier 1: Mouser; Supplier Part Number 1: 485-2491
Y2 = CMP-200220-000002-1: CRYSTAL 25.0000MHZ 8PF SMD; Manufacturer: NDK; Frequency: 25MHz; Automotive Grade: Grade 1; Esr: 100Ω; Tolerance: 15ppm; Digikey Description: CRYSTAL 25.0000MHZ 8PF SMD; Temperature Range Low: -40°C; Octopart: https://octopart.com/nx3225sa-25.000m-std-crs-2-ndk-51374293; Series: NX3225SA; Manufacturer Part Number: NX3225SA-25.000M-STD-CRS-2; ComponentLink2URL: https://www.ndk.com/images/products/catalog/c_NX3225SA-STD-CRS-2_e.pdf; Lead Free: Yes; Device Class L2: Crystals / Oscillators; ComponentLink2Description: Datasheet; Device Class L3: Crystals; Category: Crys; Device Class L1: Passive Components; Automotive: Yes; RoHS: TRUE; Load Capacitance: 8pF; Height: 0.6mm; Temperature Range High: +125°C; Package: NX3225SA; Temperature: -40°C to +125°C

## Sheet MCU_H7.SchDoc
size A4; SheetNumber: 4; SheetTotal: 6
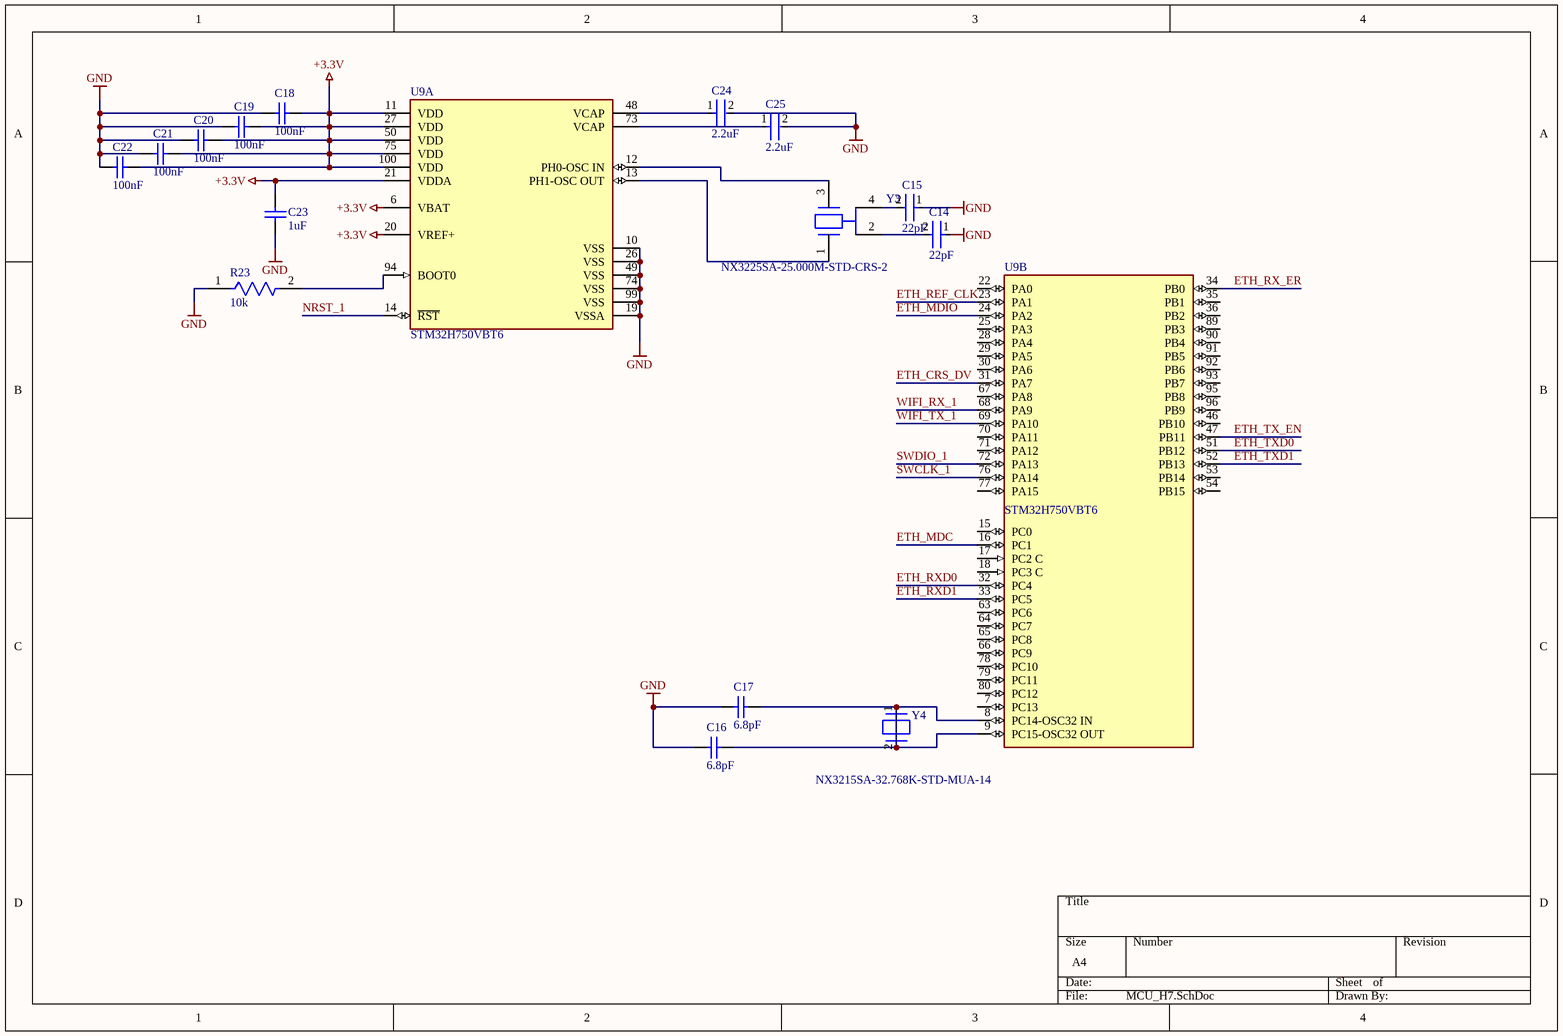
[diagram p3: MCU_H7.SchDoc]

### Parts
(Parts that share a designator on the sheet are numbered #1, #2 ... from top to bottom, then left to right.)
C14#2  22pF  [FP-C0805C-DN-MFG]
C15#2  22pF  [FP-C0805C-DN-MFG]
C16#2  6.8pF  [CAPC2013X94X50NL20T25]
C17#2  6.8pF  [CAPC2013X94X50NL20T25]
C18#2  100nF  [CAPC2013X140X50ML20T25]
C19#2  100nF  [CAPC2013X140X50ML20T25]
C20#2  100nF  [CAPC2013X140X50ML20T25]
C21  100nF  [CAPC2013X140X50ML20T25]
C22  100nF  [CAPC2013X140X50ML20T25]
C23  1uF  [CAPC2013X145X50NL20T20]
C24  2.2uF  [FP-CC0805-0_85-MFG]
C25  2.2uF  [FP-CC0805-0_85-MFG]
R23  10k  [FP-CRGP0805-IPC_C]
U9  STM32H750VBT6  [FP-LQFP100-1L-MFG]  (parts A,B of 3)
Y3  NX3225SA-25.000M-STD-CRS-2  [FP-NX3225SA-MFG]
Y4  NX3215SA-32.768K-STD-MUA-14  [FP-NX3215SA-MFG]

### Nets
+3.3V: C18#2.2 C19#2.2 C20#2.2 C21.2 C22.2 C23.2 U9.6(VBAT) U9.11(VDD) U9.20(VREF+) U9.21(VDDA) U9.27(VDD) U9.50(VDD) U9.75(VDD) U9.100(VDD)
GND: C14#2.1 C15#2.1 C16#2.1 C17#2.2 C18#2.1 C19#2.1 C20#2.1 C21.1 C22.1 C23.1 C24.2 C25.2 R23.1 U9.10(VSS) U9.19(VSSA) U9.26(VSS) U9.49(VSS) U9.74(VSS) U9.99(VSS)
ETH_CRS_DV: U9.31(PA7)
ETH_MDC: U9.16(PC1)
ETH_MDIO: U9.24(PA2)
ETH_REF_CLK: U9.23(PA1)
ETH_RX_ER: U9.34(PB0)
ETH_RXD0: U9.32(PC4)
ETH_RXD1: U9.33(PC5)
ETH_TX_EN: U9.47(PB11)
ETH_TXD0: U9.51(PB12)
ETH_TXD1: U9.52(PB13)
NRST_1: U9.14(~{RST})
SWCLK_1: U9.76(PA14)
SWDIO_1: U9.72(PA13)
WIFI_RX_1: U9.68(PA9)
WIFI_TX_1: U9.69(PA10)
NetC14#2_2: C14#2.2 Y3.2(GND)
NetC15#2_2: C15#2.2 Y3.4(GND)
NetC16#2_2: C16#2.2 C17#2.1 U9.8(PC14-OSC32_IN) U9.9(PC15-OSC32_OUT) Y4.1 Y4.2
NetC24_1: C24.1 U9.48(VCAP)
NetC25_1: C25.1 U9.73(VCAP)
NetR23_2: R23.2 U9.94(BOOT0)
NetU9_12: U9.12(PH0-OSC_IN) Y3.3
NetU9_13: U9.13(PH1-OSC_OUT) Y3.1

Not connected (* = marked no-connect by the designer): U9 7(PC13) 15(PC0) 17(PC2_C) 18(PC3_C) 22(PA0) 25(PA3) 28(PA4) 29(PA5) 30(PA6) 35(PB1) 36(PB2) 46(PB10) 53(PB14) 54(PB15) 63(PC6) 64(PC7) 65(PC8) 66(PC9) 67(PA8) 70(PA11) 71(PA12) 77(PA15) 78(PC10) 79(PC11) 80(PC12) 89(PB3) 90(PB4) 91(PB5) 92(PB6) 93(PB7) 95(PB8) 96(PB9)

### Library data of the parts
C14#2 C15#2 = CMP-2007-00314-2: as C18#1 on sheet Peripherals; ComponentLink2Description: Datasheet; Digikey Description: CAP CER 22PF 100V 10% NP0 0805; Value: 22 pF; Temperature Range High: +125°C; Package: C0805C-DN; Voltage Rating: 100 V; Octopart: https://octopart.com/c0805c220k1gactu-kemet-9138624; Capacitance: 22 pF; Lead Free: Yes; Temperature: -55°C to +125°C; Category: Cap; Device Class L3: Ceramic Capacitors; ComponentLink2URL: https://content.kemet.com/datasheets/KEM_C1003_C0G_SMD.pdf; Ipc Land Pattern Name: CAPC200125X78; Automotive: No; Mouser Description: Cap Ceramic 22pF 100V C0G 10% SMD 0805 125°C Plastic T/R; RoHS: TRUE; Height: 0.88mm; Device Class L1: Passive Components; Temperature Range Low: -55°C; Device Class L2: Capacitors
C16#2 C17#2 = CMP-2007-04154-1: Part Number: 08051A6R8DAT2A; Manufacturer: AVX Interconnect / Elco
C18#2 C19#2 C20#2 C21 C22 = CMP-2007-04651-1: Part Number: 0805DD104KAT2A; Manufacturer: AVX Interconnect / Elco
C23 = CMP-2007-01676-1: Part Number: VJ0805Y105KXQRW1BC; Manufacturer: Vitramon
C24 C25 = CMP-03422-000272-1: CAP CER 2.2UF 10V X7R 0805; Manufacturer Part Number: CC0805MKX7R6BB225; Manufacturer: Yageo; Tolerance: 0.2; Material: Ceramic; Octopart: https://octopart.com/cc0805mkx7r6bb225-yageo-81932646; Package: CC0805-0.85; Digikey Description: CAP CER 2.2UF 10V X7R 0805; Device Class L1: Passive Components; Value: 2.2 uF; Temperature: -30°C to +85°C; Footprint Url: http://www.yageo.com/exep/pages/download/literatures/UPY-C_GEN_24.pdf; Capacitance: 2.2 uF; Lead Free: Yes; Automotive: No; Temperature Characteristic: X7R; Voltage Rating: 10 V; Ipc Land Pattern Name: CAPC200125X85; ComponentLink2Description: Datasheet; Height: 0.95mm; Device Class L3: Ceramic Capacitors; ComponentLink2URL: http://www.yageo.com/documents/recent/UPY-GPHC_Y5V_6.3V-to-50V_8.pdf; Category: Cap; Temperature Range Low: -30°C; Temperature Range High: +85°C; RoHS: TRUE; Device Class L2: Capacitors
R23 = CMP-03211-006861-1: as R7 on sheet Power_and_ST-link_zone; ComponentLink2URL: https://www.mouser.com/datasheet/2/418/NG_DS_9-1773463-9_A-1358566.pdf; Temperature Range Low: -55°C; Ipc Land Pattern Name: RESC200125X55; Device Class L2: Resistors; Automotive: No; Device Class L3: Chip SMD Resistors; Composition: Thick Film; Temperature Range High: +155°C; Temperature: -55°C to +155°C; Height: 0.65mm; Series: CRGP; RoHS: TRUE; Device Class L1: Passive Components; Octopart: https://octopart.com/crgp0805f10k-te+connectivity-91018782; Package: CRGP0805; Digikey Description: CRGP 0805 10K 1%; Ambient Temperature Range High: +70°C; Lead Free: Yes; ComponentLink2Description: Datasheet; Category: Res; Resistance: 10KΩ
U9 = CMP-12105-000017-1: IC MCU 32BIT 128KB FLASH 100LQFP; Manufacturer: STMicroelectronics; Number Of Uart Channels: 9; Number Of I/Os: 82; Max Junction Temp: +125°C; Data Bus Width: 32bits; Ram Size: 1MBytes; Min Supply Voltage: 1.62V; Number Of Spi Channels: 6; Number Of Adc Channels: 36; Max Supply Voltage: 3.6V; Standoff Height: 0.05mm; Interface: I2C,SPI,UART,USART,CAN,USB,LIN,IrDA,Ethernet,I2S,Other; Number Of A/D Converters: 3; Number Of I2C Channels: 4; Memory Size: 128KBytes; Frequency: 480MHz; Number Of Timers/Counters: 20; Number Of Ethernet Channels: 1; Core Architecture: ARM Cortex-M7; Number Of Usb Channels: 2; Number Of Pwm Channels: 42; Ambient Temperature Range High: +85°C; Temperature: -40°C to +125°C; ComponentLink2URL: https://www.st.com/resource/en/datasheet/stm32h750vb.pdf; Device Class L2: Embedded Processors and Controllers; Temperature Range Low: -40°C; Octopart: https://octopart.com/stm32h750vbt6-stmicroelectronics-94048547; Category: IC; Manufacturer Part Number: STM32H750VBT6; Height: 1.6mm; Lead Free: Yes; Device Class L1: Integrated Circuits (ICs); Digikey Description: IC MCU 32BIT 128KB FLASH 100LQFP; RoHS: TRUE; Ambient Temperature Range Low: -40°C; Device Class L3: Microcontrollers; ComponentLink2Description: Datasheet; Mouser Description: MCU 32-Bit STM32H750VB ARM Cortex M7 RISC 128KB Flash 1.8V/2.5V/3.3V 100-Pin LQFP Tray; Number Of Cores: 1; Automotive: No; Memory Type: FLASH; Package: LQFP100-1L; Temperature Range High: +125°C
Y3 = CMP-200220-000002-1: as Y2 on sheet Peripherals; Digikey Description: CRYSTAL 25.0000MHZ 8PF SMD; Temperature Range Low: -40°C; Octopart: https://octopart.com/nx3225sa-25.000m-std-crs-2-ndk-51374293; Series: NX3225SA; Manufacturer Part Number: NX3225SA-25.000M-STD-CRS-2; ComponentLink2URL: https://www.ndk.com/images/products/catalog/c_NX3225SA-STD-CRS-2_e.pdf; Lead Free: Yes; Device Class L2: Crystals / Oscillators; ComponentLink2Description: Datasheet; Device Class L3: Crystals; Category: Crys; Device Class L1: Passive Components; Automotive: Yes; RoHS: TRUE; Load Capacitance: 8pF; Height: 0.6mm; Temperature Range High: +125°C; Package: NX3225SA; Temperature: -40°C to +125°C
Y4 = CMP-00536-22488149-1: NX3215SA-32.768K-STD-MUA-14 Parallel - Fundamental Quartz Crystal, 0.032768MHz Nom; ESR (Equivalent Series Resistance): 70kΩ; Frequency Tolerance: 0.002%; Load Capacitance: 6pF; Frequency: 32.768kHz; Width: 1.4986mm; Length: 3.2004mm; RoHS: Compliant; Case/Package: SMD/SMT; Mount: Surface Mount; Height: 889µm; Number of Pins: 2; Packaging: Tape & Reel (TR); Max Operating Temperature: 85°C; NexarPartId: 22488149; Min Operating Temperature: -40°C

## Sheet MCU_L4.SchDoc
size A4; SheetNumber: 5; SheetTotal: 6
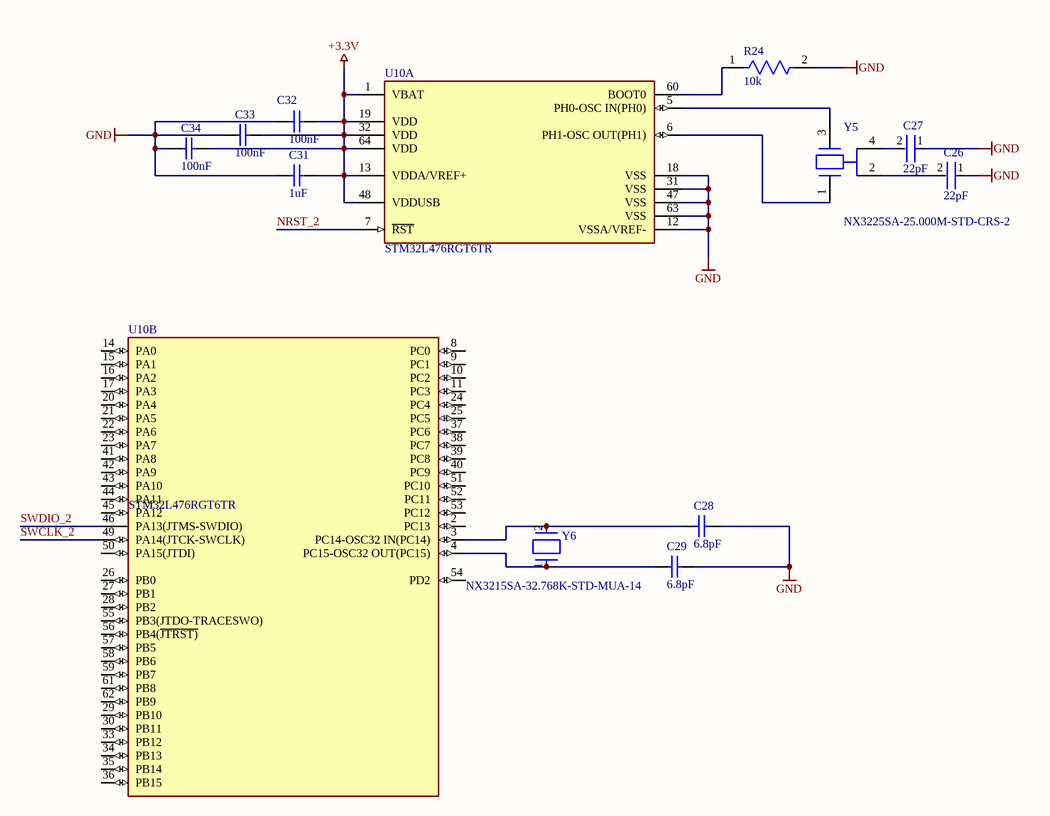
[diagram p4: MCU_L4.SchDoc]

### Parts
C26  22pF  [FP-C0805C-DN-MFG]
C27  22pF  [FP-C0805C-DN-MFG]
C28  6.8pF  [CAPC2013X94X50NL20T25]
C29  6.8pF  [CAPC2013X94X50NL20T25]
C31  1uF  [CAPC2013X145X50NL20T20]
C32  100nF  [CAPC2013X140X50ML20T25]
C33  100nF  [CAPC2013X140X50ML20T25]
C34  100nF  [CAPC2013X140X50ML20T25]
R24  10k  [FP-CRGP0805-IPC_C]
U10  STM32L476RGT6TR  [FP-LQFP64-5W-MFG]  (parts A,B of 2)
Y5  NX3225SA-25.000M-STD-CRS-2  [FP-NX3225SA-MFG]
Y6  NX3215SA-32.768K-STD-MUA-14  [FP-NX3215SA-MFG]

### Nets
+3.3V: C31.1 C32.2 C33.2 C34.2 U10.1(VBAT) U10.13(VDDA/VREF+) U10.19(VDD) U10.32(VDD) U10.48(VDDUSB) U10.64(VDD)
GND: C26.1 C27.1 C28.1 C29.2 C31.2 C32.1 C33.1 C34.1 R24.2 U10.12(VSSA/VREF-) U10.18(VSS) U10.31(VSS) U10.47(VSS) U10.63(VSS)
NRST_2: U10.7(~{RST})
SWCLK_2: U10.49(PA14(JTCK-SWCLK))
SWDIO_2: U10.46(PA13(JTMS-SWDIO))
NetC26_2: C26.2 Y5.2(GND)
NetC27_2: C27.2 Y5.4(GND)
NetC28_2: C28.2 U10.3(PC14-OSC32_IN(PC14)) Y6.2
NetC29_1: C29.1 U10.4(PC15-OSC32_OUT(PC15)) Y6.1
NetR24_1: R24.1 U10.60(BOOT0)
NetU10_5: U10.5(PH0-OSC_IN(PH0)) Y5.3
NetU10_6: U10.6(PH1-OSC_OUT(PH1)) Y5.1

Not connected (* = marked no-connect by the designer): U10 2(PC13) 8(PC0) 9(PC1) 10(PC2) 11(PC3) 14(PA0) 15(PA1) 16(PA2) 17(PA3) 20(PA4) 21(PA5) 22(PA6) 23(PA7) 24(PC4) 25(PC5) 26(PB0) 27(PB1) 28(PB2) 29(PB10) 30(PB11) 33(PB12) 34(PB13) 35(PB14) 36(PB15) 37(PC6) 38(PC7) 39(PC8) 40(PC9) 41(PA8) 42(PA9) 43(PA10) 44(PA11) 45(PA12) 50(PA15(JTDI)) 51(PC10) 52(PC11) 53(PC12) 54(PD2) 55(PB3(JTDO-TRACESWO)) 56(PB4(~{JTRST)}) 57(PB5) 58(PB6) 59(PB7) 61(PB8) 62(PB9)

### Library data of the parts
C26 C27 = CMP-2007-00314-2: as C18#1 on sheet Peripherals; ComponentLink2Description: Datasheet; Digikey Description: CAP CER 22PF 100V 10% NP0 0805; Value: 22 pF; Temperature Range High: +125°C; Package: C0805C-DN; Voltage Rating: 100 V; Octopart: https://octopart.com/c0805c220k1gactu-kemet-9138624; Capacitance: 22 pF; Lead Free: Yes; Temperature: -55°C to +125°C; Category: Cap; Device Class L3: Ceramic Capacitors; ComponentLink2URL: https://content.kemet.com/datasheets/KEM_C1003_C0G_SMD.pdf; Ipc Land Pattern Name: CAPC200125X78; Automotive: No; Mouser Description: Cap Ceramic 22pF 100V C0G 10% SMD 0805 125°C Plastic T/R; RoHS: TRUE; Height: 0.88mm; Device Class L1: Passive Components; Temperature Range Low: -55°C; Device Class L2: Capacitors
C28 C29 = CMP-2007-04154-1: as C16#2 on sheet MCU_H7
C31 = CMP-2007-01676-1: as C23 on sheet MCU_H7
C32-C34 = CMP-2007-04651-1: as C18#2 on sheet MCU_H7
R24 = CMP-03211-006861-1: as R7 on sheet Power_and_ST-link_zone; ComponentLink2URL: https://www.mouser.com/datasheet/2/418/NG_DS_9-1773463-9_A-1358566.pdf; Temperature Range Low: -55°C; Ipc Land Pattern Name: RESC200125X55; Device Class L2: Resistors; Automotive: No; Device Class L3: Chip SMD Resistors; Composition: Thick Film; Temperature Range High: +155°C; Temperature: -55°C to +155°C; Height: 0.65mm; Series: CRGP; RoHS: TRUE; Device Class L1: Passive Components; Octopart: https://octopart.com/crgp0805f10k-te+connectivity-91018782; Package: CRGP0805; Digikey Description: CRGP 0805 10K 1%; Ambient Temperature Range High: +70°C; Lead Free: Yes; ComponentLink2Description: Datasheet; Category: Res; Resistance: 10KΩ
U10 = CMP-12105-000039-1: IC MCU 32BIT 1MB FLASH 64LQFP; Manufacturer: STMicroelectronics; Number Of Timers/Counters: 13; Number Of Spi Channels: 3; Number Of Pwm Channels: 28; Number Of Usb Channels: 1; Frequency: 80MHz; Data Bus Width: 32bits; Max Supply Voltage: 3.6V; Ram Size: 128KBytes; Memory Size: 1MBytes; Number Of Uart Channels: 6; Number Of Adc Channels: 16; Core Architecture: ARM Cortex-M4; Standoff Height: 0.05mm; Interface: I2C,SPI,UART,USART,CAN,USB,LIN,IrDA,SMBus,Other; Max Junction Temp: +105°C; Min Supply Voltage: 1.71V; Number Of I/Os: 51; Temperature Range Low: -40°C; Automotive: No; Ambient Temperature Range Low: -40°C; ComponentLink2URL: https://www.st.com/content/ccc/resource/technical/document/datasheet/c5/ed/2f/60/aa/79/42/0b/DM00108832.pdf/files/DM00108832.pdf/jcr:content/translations/en.DM00108832.pdf; Temperature: -40°C to +105°C; Device Class L1: Integrated Circuits (ICs); Package: LQFP64-5W; Category: IC; Memory Type: FLASH; Digikey Description: IC MCU 32BIT 1MB FLASH 64LQFP; Number Of A/D Converters: 3; Number Of I2C Channels: 3; Temperature Range High: +105°C; Lead Free: Yes; Number Of Cores: 1; Height: 1.6mm; Ambient Temperature Range High: +85°C; Device Class L2: Embedded Processors and Controllers; Octopart: https://octopart.com/stm32l476rgt6tr-stmicroelectronics-74146120; RoHS: TRUE; Ipc Land Pattern Name: QFP50P1200X1200X160-64; Mouser Description: MCU 32-Bit STM32 ARM Cortex M4 RISC 1MB Flash 1.8V/2.5V/3.3V 64-Pin LQFP T/R; ComponentLink2Description: Datasheet; Manufacturer Part Number: STM32L476RGT6TR; Device Class L3: Microcontrollers
Y5 = CMP-200220-000002-1: as Y2 on sheet Peripherals; Digikey Description: CRYSTAL 25.0000MHZ 8PF SMD; Temperature Range Low: -40°C; Octopart: https://octopart.com/nx3225sa-25.000m-std-crs-2-ndk-51374293; Series: NX3225SA; Manufacturer Part Number: NX3225SA-25.000M-STD-CRS-2; ComponentLink2URL: https://www.ndk.com/images/products/catalog/c_NX3225SA-STD-CRS-2_e.pdf; Lead Free: Yes; Device Class L2: Crystals / Oscillators; ComponentLink2Description: Datasheet; Device Class L3: Crystals; Category: Crys; Device Class L1: Passive Components; Automotive: Yes; RoHS: TRUE; Load Capacitance: 8pF; Height: 0.6mm; Temperature Range High: +125°C; Package: NX3225SA; Temperature: -40°C to +125°C
Y6 = CMP-00536-22488149-1: as Y4 on sheet MCU_H7; Width: 1.4986mm; Length: 3.2004mm; RoHS: Compliant; Case/Package: SMD/SMT; Mount: Surface Mount; Height: 889µm; Number of Pins: 2; Packaging: Tape & Reel (TR); Max Operating Temperature: 85°C; NexarPartId: 22488149; Min Operating Temperature: -40°C